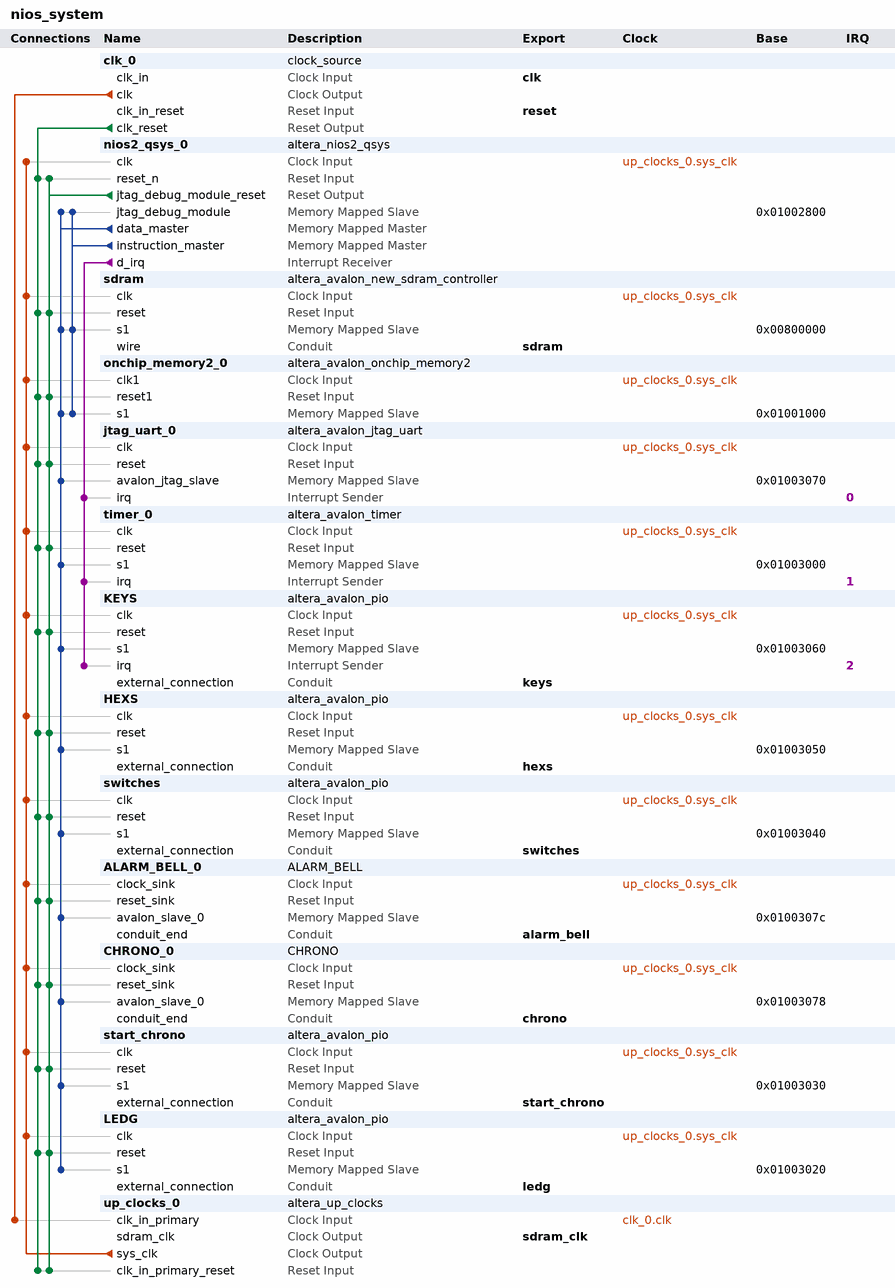
[diagram p0: system contents]
# Platform Designer (Qsys) system nios_system, Cyclone II EP2C20F484C7
# Parameters at their usual value, and those the tool derives, are not listed.
package require -exact qsys 13.0.1.99.2
create_system nios_system
set_project_property DEVICE_FAMILY {Cyclone II}
set_project_property DEVICE EP2C20F484C7

add_instance clk_0 clock_source 13.0
set_instance_parameter_value clk_0 clockFrequency 50000000

add_instance nios2_qsys_0 altera_nios2_qsys 13.0
set_instance_parameter_value nios2_qsys_0 resetSlave sdram.s1
set_instance_parameter_value nios2_qsys_0 mmu_TLBMissExcSlave None
set_instance_parameter_value nios2_qsys_0 exceptionSlave sdram.s1
set_instance_parameter_value nios2_qsys_0 breakSlave nios2_qsys_0.jtag_debug_module
set_instance_parameter_value nios2_qsys_0 impl Tiny
set_instance_parameter_value nios2_qsys_0 icache_size 4096

add_instance sdram altera_avalon_new_sdram_controller 13.0.1.99.2
set_instance_parameter_value sdram TAC 5.5
set_instance_parameter_value sdram TRCD 20.0
set_instance_parameter_value sdram TRP 20.0
set_instance_parameter_value sdram casLatency 3
set_instance_parameter_value sdram columnWidth 8
set_instance_parameter_value sdram dataWidth 16
set_instance_parameter_value sdram generateSimulationModel false
set_instance_parameter_value sdram model single_Micron_MT48LC4M32B2_7_chip
set_instance_parameter_value sdram numberOfBanks 4
set_instance_parameter_value sdram numberOfChipSelects 1
set_instance_parameter_value sdram powerUpDelay 100.0
set_instance_parameter_value sdram refreshPeriod 15.625
set_instance_parameter_value sdram rowWidth 12

add_instance onchip_memory2_0 altera_avalon_onchip_memory2 13.0.1.99.2
set_instance_parameter_value onchip_memory2_0 dataWidth 32
set_instance_parameter_value onchip_memory2_0 dualPort false
set_instance_parameter_value onchip_memory2_0 initMemContent true
set_instance_parameter_value onchip_memory2_0 initializationFileName onchip_mem.hex
set_instance_parameter_value onchip_memory2_0 memorySize 4096

add_instance jtag_uart_0 altera_avalon_jtag_uart 13.0.1.99.2
set_instance_parameter_value jtag_uart_0 simInteractiveOptions NO_INTERACTIVE_WINDOWS

add_instance timer_0 altera_avalon_timer 13.0.1.99.2
set_instance_parameter_value timer_0 period 1
set_instance_parameter_value timer_0 periodUnits SEC
set_instance_parameter_value timer_0 snapshot false

add_instance KEYS altera_avalon_pio 13.0.1.99.2
set_instance_parameter_value KEYS captureEdge true
set_instance_parameter_value KEYS direction Input
set_instance_parameter_value KEYS edgeType FALLING
set_instance_parameter_value KEYS generateIRQ true
set_instance_parameter_value KEYS irqType EDGE
set_instance_parameter_value KEYS width 4

add_instance HEXS altera_avalon_pio 13.0.1.99.2
set_instance_parameter_value HEXS direction Output
set_instance_parameter_value HEXS width 16

add_instance switches altera_avalon_pio 13.0.1.99.2
set_instance_parameter_value switches direction Input
set_instance_parameter_value switches width 10

add_instance ALARM_BELL_0 ALARM_BELL 1.0
set_instance_parameter_value ALARM_BELL_0 Fclock 50000000
set_instance_parameter_value ALARM_BELL_0 FTick 1000
set_instance_parameter_value ALARM_BELL_0 N 250

add_instance CHRONO_0 CHRONO 1.0
set_instance_parameter_value CHRONO_0 Fclock 50000000
set_instance_parameter_value CHRONO_0 FTick 1000
set_instance_parameter_value CHRONO_0 N 1000

add_instance start_chrono altera_avalon_pio 13.0.1.99.2
set_instance_parameter_value start_chrono direction Output
set_instance_parameter_value start_chrono width 8

add_instance LEDG altera_avalon_pio 13.0.1.99.2
set_instance_parameter_value LEDG direction Output
set_instance_parameter_value LEDG width 8

add_instance up_clocks_0 altera_up_clocks 13.0
set_instance_parameter_value up_clocks_0 board DE1
set_instance_parameter_value up_clocks_0 vga_clk false
set_instance_parameter_value up_clocks_0 audio_clk false
set_instance_parameter_value up_clocks_0 audio_clk_freq 12.288

# connections
add_connection clk_0.clk up_clocks_0.clk_in_primary clock
add_connection up_clocks_0.sys_clk ALARM_BELL_0.clock_sink clock
add_connection up_clocks_0.sys_clk CHRONO_0.clock_sink clock
add_connection up_clocks_0.sys_clk HEXS.clk clock
add_connection up_clocks_0.sys_clk jtag_uart_0.clk clock
add_connection up_clocks_0.sys_clk KEYS.clk clock
add_connection up_clocks_0.sys_clk LEDG.clk clock
add_connection up_clocks_0.sys_clk nios2_qsys_0.clk clock
add_connection up_clocks_0.sys_clk onchip_memory2_0.clk1 clock
add_connection up_clocks_0.sys_clk sdram.clk clock
add_connection up_clocks_0.sys_clk start_chrono.clk clock
add_connection up_clocks_0.sys_clk switches.clk clock
add_connection up_clocks_0.sys_clk timer_0.clk clock
add_connection clk_0.clk_reset ALARM_BELL_0.reset_sink reset
add_connection clk_0.clk_reset CHRONO_0.reset_sink reset
add_connection clk_0.clk_reset HEXS.reset reset
add_connection clk_0.clk_reset jtag_uart_0.reset reset
add_connection clk_0.clk_reset KEYS.reset reset
add_connection clk_0.clk_reset LEDG.reset reset
add_connection clk_0.clk_reset nios2_qsys_0.reset_n reset
add_connection clk_0.clk_reset onchip_memory2_0.reset1 reset
add_connection clk_0.clk_reset sdram.reset reset
add_connection clk_0.clk_reset start_chrono.reset reset
add_connection clk_0.clk_reset switches.reset reset
add_connection clk_0.clk_reset timer_0.reset reset
add_connection clk_0.clk_reset up_clocks_0.clk_in_primary_reset reset
add_connection nios2_qsys_0.jtag_debug_module_reset ALARM_BELL_0.reset_sink reset
add_connection nios2_qsys_0.jtag_debug_module_reset CHRONO_0.reset_sink reset
add_connection nios2_qsys_0.jtag_debug_module_reset HEXS.reset reset
add_connection nios2_qsys_0.jtag_debug_module_reset jtag_uart_0.reset reset
add_connection nios2_qsys_0.jtag_debug_module_reset KEYS.reset reset
add_connection nios2_qsys_0.jtag_debug_module_reset LEDG.reset reset
add_connection nios2_qsys_0.jtag_debug_module_reset nios2_qsys_0.reset_n reset
add_connection nios2_qsys_0.jtag_debug_module_reset onchip_memory2_0.reset1 reset
add_connection nios2_qsys_0.jtag_debug_module_reset sdram.reset reset
add_connection nios2_qsys_0.jtag_debug_module_reset start_chrono.reset reset
add_connection nios2_qsys_0.jtag_debug_module_reset switches.reset reset
add_connection nios2_qsys_0.jtag_debug_module_reset timer_0.reset reset
add_connection nios2_qsys_0.jtag_debug_module_reset up_clocks_0.clk_in_primary_reset reset
add_connection nios2_qsys_0.data_master ALARM_BELL_0.avalon_slave_0 avalon
set_connection_parameter_value nios2_qsys_0.data_master/ALARM_BELL_0.avalon_slave_0 baseAddress 0x0100307c
add_connection nios2_qsys_0.data_master CHRONO_0.avalon_slave_0 avalon
set_connection_parameter_value nios2_qsys_0.data_master/CHRONO_0.avalon_slave_0 baseAddress 0x01003078
add_connection nios2_qsys_0.data_master HEXS.s1 avalon
set_connection_parameter_value nios2_qsys_0.data_master/HEXS.s1 baseAddress 0x01003050
add_connection nios2_qsys_0.data_master jtag_uart_0.avalon_jtag_slave avalon
set_connection_parameter_value nios2_qsys_0.data_master/jtag_uart_0.avalon_jtag_slave baseAddress 0x01003070
add_connection nios2_qsys_0.data_master KEYS.s1 avalon
set_connection_parameter_value nios2_qsys_0.data_master/KEYS.s1 baseAddress 0x01003060
add_connection nios2_qsys_0.data_master LEDG.s1 avalon
set_connection_parameter_value nios2_qsys_0.data_master/LEDG.s1 baseAddress 0x01003020
add_connection nios2_qsys_0.data_master nios2_qsys_0.jtag_debug_module avalon
set_connection_parameter_value nios2_qsys_0.data_master/nios2_qsys_0.jtag_debug_module baseAddress 0x01002800
add_connection nios2_qsys_0.data_master onchip_memory2_0.s1 avalon
set_connection_parameter_value nios2_qsys_0.data_master/onchip_memory2_0.s1 baseAddress 0x01001000
add_connection nios2_qsys_0.data_master sdram.s1 avalon
set_connection_parameter_value nios2_qsys_0.data_master/sdram.s1 baseAddress 0x00800000
add_connection nios2_qsys_0.data_master start_chrono.s1 avalon
set_connection_parameter_value nios2_qsys_0.data_master/start_chrono.s1 baseAddress 0x01003030
add_connection nios2_qsys_0.data_master switches.s1 avalon
set_connection_parameter_value nios2_qsys_0.data_master/switches.s1 baseAddress 0x01003040
add_connection nios2_qsys_0.data_master timer_0.s1 avalon
set_connection_parameter_value nios2_qsys_0.data_master/timer_0.s1 baseAddress 0x01003000
add_connection nios2_qsys_0.instruction_master nios2_qsys_0.jtag_debug_module avalon
set_connection_parameter_value nios2_qsys_0.instruction_master/nios2_qsys_0.jtag_debug_module baseAddress 0x01002800
add_connection nios2_qsys_0.instruction_master onchip_memory2_0.s1 avalon
set_connection_parameter_value nios2_qsys_0.instruction_master/onchip_memory2_0.s1 baseAddress 0x01001000
add_connection nios2_qsys_0.instruction_master sdram.s1 avalon
set_connection_parameter_value nios2_qsys_0.instruction_master/sdram.s1 baseAddress 0x00800000
add_connection nios2_qsys_0.d_irq jtag_uart_0.irq interrupt
set_connection_parameter_value nios2_qsys_0.d_irq/jtag_uart_0.irq irqNumber 0
add_connection nios2_qsys_0.d_irq KEYS.irq interrupt
set_connection_parameter_value nios2_qsys_0.d_irq/KEYS.irq irqNumber 2
add_connection nios2_qsys_0.d_irq timer_0.irq interrupt
set_connection_parameter_value nios2_qsys_0.d_irq/timer_0.irq irqNumber 1

# exported interfaces
add_interface clk clock sink
set_interface_property clk EXPORT_OF clk_0.clk_in
add_interface reset reset sink
set_interface_property reset EXPORT_OF clk_0.clk_in_reset
add_interface sdram conduit end
set_interface_property sdram EXPORT_OF sdram.wire
add_interface sdram_clk clock source
set_interface_property sdram_clk EXPORT_OF up_clocks_0.sdram_clk
add_interface keys conduit end
set_interface_property keys EXPORT_OF KEYS.external_connection
add_interface hexs conduit end
set_interface_property hexs EXPORT_OF HEXS.external_connection
add_interface switches conduit end
set_interface_property switches EXPORT_OF switches.external_connection
add_interface start_chrono conduit end
set_interface_property start_chrono EXPORT_OF start_chrono.external_connection
add_interface alarm_bell conduit end
set_interface_property alarm_bell EXPORT_OF ALARM_BELL_0.conduit_end
add_interface chrono conduit end
set_interface_property chrono EXPORT_OF CHRONO_0.conduit_end
add_interface ledg conduit end
set_interface_property ledg EXPORT_OF LEDG.external_connection

set_interconnect_requirement {$system} qsys_mm.clockCrossingAdapter HANDSHAKE
set_interconnect_requirement {$system} qsys_mm.maxAdditionalLatency 1

save_system nios_system.qsys
